# EAGLE design PWM Shield SMD (EAGLE 6.3)
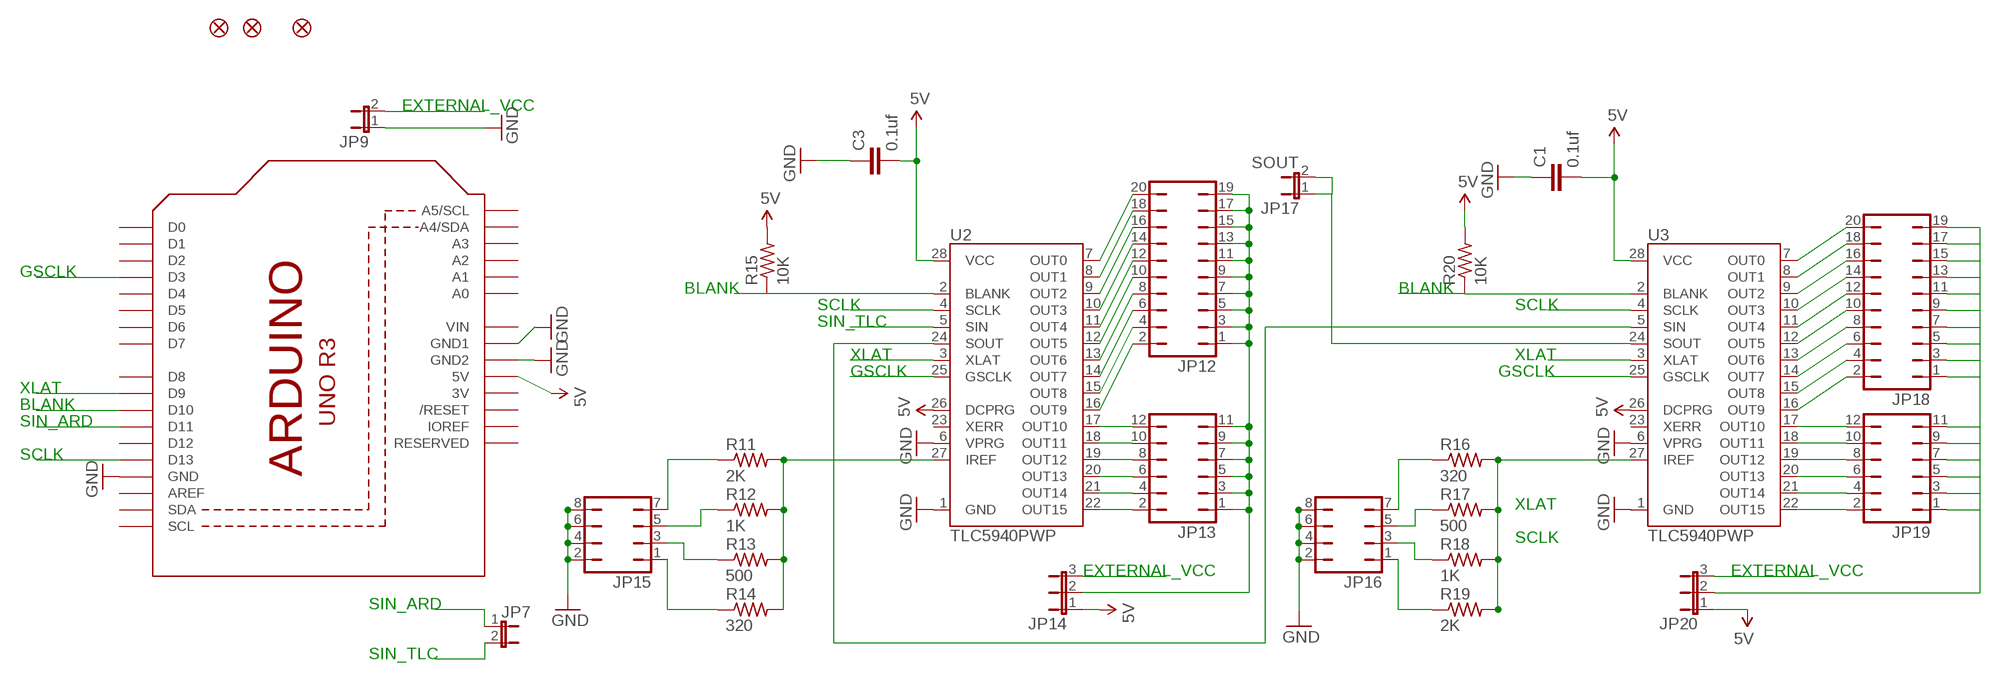
[diagram p0: schematic, sheet 1]

## Parts
C1  0.1uf  C-EUC0603  [C0603]
C3  0.1uf  C-EUC0603  [C0603]
JP1  FIDUCIAL1.5X3  [FIDUCIAL-1.5X3]
JP2  FIDUCIAL1.5X3  [FIDUCIAL-1.5X3]
JP3  FIDUCIAL1.5X3  [FIDUCIAL-1.5X3]
JP7  JP1E  [JP1]
JP9  JP1E  [JP1]
JP12  JP10Q  [JP10Q]
JP13  JP6Q  [JP6Q]
JP14  JP2E  [JP2]
JP15  JP4Q  [JP4Q]
JP16  JP4Q  [JP4Q]
JP17  SOUT  JP1E  [JP1]
JP18  JP10Q  [JP10Q]
JP19  JP6Q  [JP6Q]
JP20  JP2E  [JP2]
R11  2K  R-US_R0603  [R0603]
R12  1K  R-US_0204/7  [0204/7]
R13  500  R-US_0204/7  [0204/7]
R14  320  R-US_0204/7  [0204/7]
R15  10K  R-US_R0603  [R0603]
R16  320  R-US_0204/7  [0204/7]
R17  500  R-US_0204/7  [0204/7]
R18  1K  R-US_0204/7  [0204/7]
R19  2K  R-US_R0603  [R0603]
R20  10K  R-US_R0603  [R0603]
U1  ARDUINOR3-DIMENSION  [ARDUINOR3]
U2  TLC5940PWP  [TSSOP28-GROUNDPAD]
U3  TLC5940PWP  [TSSOP28-GROUNDPAD]

## Nets
5V [VCCPower]: C1.2 C3.2 JP14.1 JP20.1 R15.2 R20.2 U1.5V U2.26(DCPRG) U2.28(VCC) U3.26(DCPRG) U3.28(VCC)
BLANK: R15.1 R20.1 U1.D10 U2.2(BLANK) U3.2(BLANK)
EXTERNAL_VCC [VCCPower]: JP9.2 JP14.3 JP20.3
GND [GND]: C1.1 C3.1 JP9.1 JP15.2 JP15.4 JP15.6 JP15.8 JP16.2 JP16.4 JP16.6 JP16.8 U1.GND U1.GND1 U1.GND2 U2.1(GND) U2.6(VPRG) U3.1(GND) U3.6(VPRG)
GSCLK: U1.D3 U2.25(GSCLK) U3.25(GSCLK)
N$1: JP17.1 JP17.2 U3.24(SOUT)
N$47: JP12.2 U2.16(OUT9)
N$48: JP12.4 U2.15(OUT8)
N$49: JP12.6 U2.14(OUT7)
N$50: JP12.8 U2.13(OUT6)
N$51: JP12.10 U2.12(OUT5)
N$52: JP12.12 U2.11(OUT4)
N$53: JP12.14 U2.10(OUT3)
N$54: JP12.16 U2.9(OUT2)
N$55: JP12.18 U2.8(OUT1)
N$56: JP12.20 U2.7(OUT0)
N$57: JP13.2 U2.22(OUT15)
N$58: JP13.4 U2.21(OUT14)
N$59: JP13.6 U2.20(OUT13)
N$60: JP13.8 U2.19(OUT12)
N$61: JP13.10 U2.18(OUT11)
N$62: JP13.12 U2.17(OUT10)
N$63 [VCCPower]: JP12.1 JP12.3 JP12.5 JP12.7 JP12.9 JP12.11 JP12.13 JP12.15 JP12.17 JP12.19 JP13.1 JP13.3 JP13.5 JP13.7 JP13.9 JP13.11 JP14.2
N$65: R11.2 R12.2 R13.2 R14.2 U2.27(IREF)
N$66: JP15.1 R14.1
N$67: JP15.3 R13.1
N$68: JP15.5 R12.1
N$69: JP15.7 R11.1
N$71: R16.2 R17.2 R18.2 R19.2 U3.27(IREF)
N$72: JP16.1 R19.1
N$73: JP16.3 R18.1
N$74: JP16.5 R17.1
N$75: JP16.7 R16.1
N$77: JP18.2 U3.16(OUT9)
N$78: JP18.4 U3.15(OUT8)
N$79: JP18.6 U3.14(OUT7)
N$80: JP18.8 U3.13(OUT6)
N$81: JP18.10 U3.12(OUT5)
N$82: JP18.12 U3.11(OUT4)
N$83: JP18.14 U3.10(OUT3)
N$84: JP18.16 U3.9(OUT2)
N$85: JP18.18 U3.8(OUT1)
N$86: JP18.20 U3.7(OUT0)
N$87: JP19.2 U3.22(OUT15)
N$88: JP19.4 U3.21(OUT14)
N$89: JP19.6 U3.20(OUT13)
N$90: JP19.8 U3.19(OUT12)
N$91: JP19.10 U3.18(OUT11)
N$92: JP19.12 U3.17(OUT10)
N$93 [VCCPower]: JP18.1 JP18.3 JP18.5 JP18.7 JP18.9 JP18.11 JP18.13 JP18.15 JP18.17 JP18.19 JP19.1 JP19.3 JP19.5 JP19.7 JP19.9 JP19.11 JP20.2
SCLK: U1.D13 U2.4(SCLK) U3.4(SCLK)
SIN_ARD: JP7.1 U1.D11
SIN_TLC: JP7.2 U2.5(SIN)
SOUT_1: U2.24(SOUT) U3.5(SIN)
XLAT: U1.D9 U2.3(XLAT) U3.3(XLAT)
Unconnected: U1.A0 U1.A1 U1.A2 U1.A3 U1.A4(A4/SDA) U1.A5(A5/SCL) U1.AREF U1.D0 U1.D1 U1.D2 U1.D4 U1.D5 U1.D6 U1.D7 U1.D8 U1.D12 U1.IOREF U1.RESERVED U1.RESET(/RESET) U1.SCL U1.SDA U2.23(XERR) U3.23(XERR)

## Notes on the sheet
- EXTERNAL_VCC
- GSCLK
- BLANK | BLANK
- SCLK | SCLK
- SIN_TLC
- XLAT | XLAT
- GSCLK | GSCLK
- XLAT
- BLANK
- SIN_ARD
- SCLK
- XLAT
- SCLK
- EXTERNAL_VCC | EXTERNAL_VCC
- SIN_ARD
- SIN_TLC

## Power pins joined to a net without a drawn wire
3V: U1.3V
VIN: U1.VIN

## Library data of the parts
C1 C3 = rcl:C-EU: CAPACITOR, European symbol
JP1-JP3 = SparkFun:FIDUCIAL: Fiducial Alignment Points Various fiducial points for machine vision alignment.
JP7 JP9 JP17 = jumper:JP1E: JUMPER
JP12 JP18 = jumper:JP10Q: JUMPER
JP13 JP19 = jumper:JP6Q: JUMPER
JP14 JP20 = jumper:JP2E: JUMPER
JP15 JP16 = jumper:JP4Q: JUMPER
R11-R20 = resistor:R-US_: RESISTOR, American symbol
U1 = adafruit:ARDUINOR3: This is a new object for the new Arduino R3 - with extra pins that you may want to use (such as IOref, and duplicated A4/A5
U2 U3 = SparkFun:TLC5940: TI TLC5940 16-channel LED Driver with Dot Correction and Grayscale PWM Control The TLC5940 is a 16-channel, constant-current sink LED driver. Each channel has an individually adjustable 4096-step grayscale PWM brightness control and a 64-step, constant-current sink (dot correction). The dot correction adjusts the brightness variations between LED channels and other LED drivers. The dot correction data is stored in an integrated EEPROM. Both grayscale control and dot correction are accessible via a serial interface. A single external resistor sets the maximum current value of all 16 channels. Packages: 28-pin HTSSOP 32-pin 5x5mm QFN 28-pin DIP

## Net classes
0 default: width 0.203 mm
1 VCCPower: width 0.356 mm
2 GND: width 0.356 mm

## Board
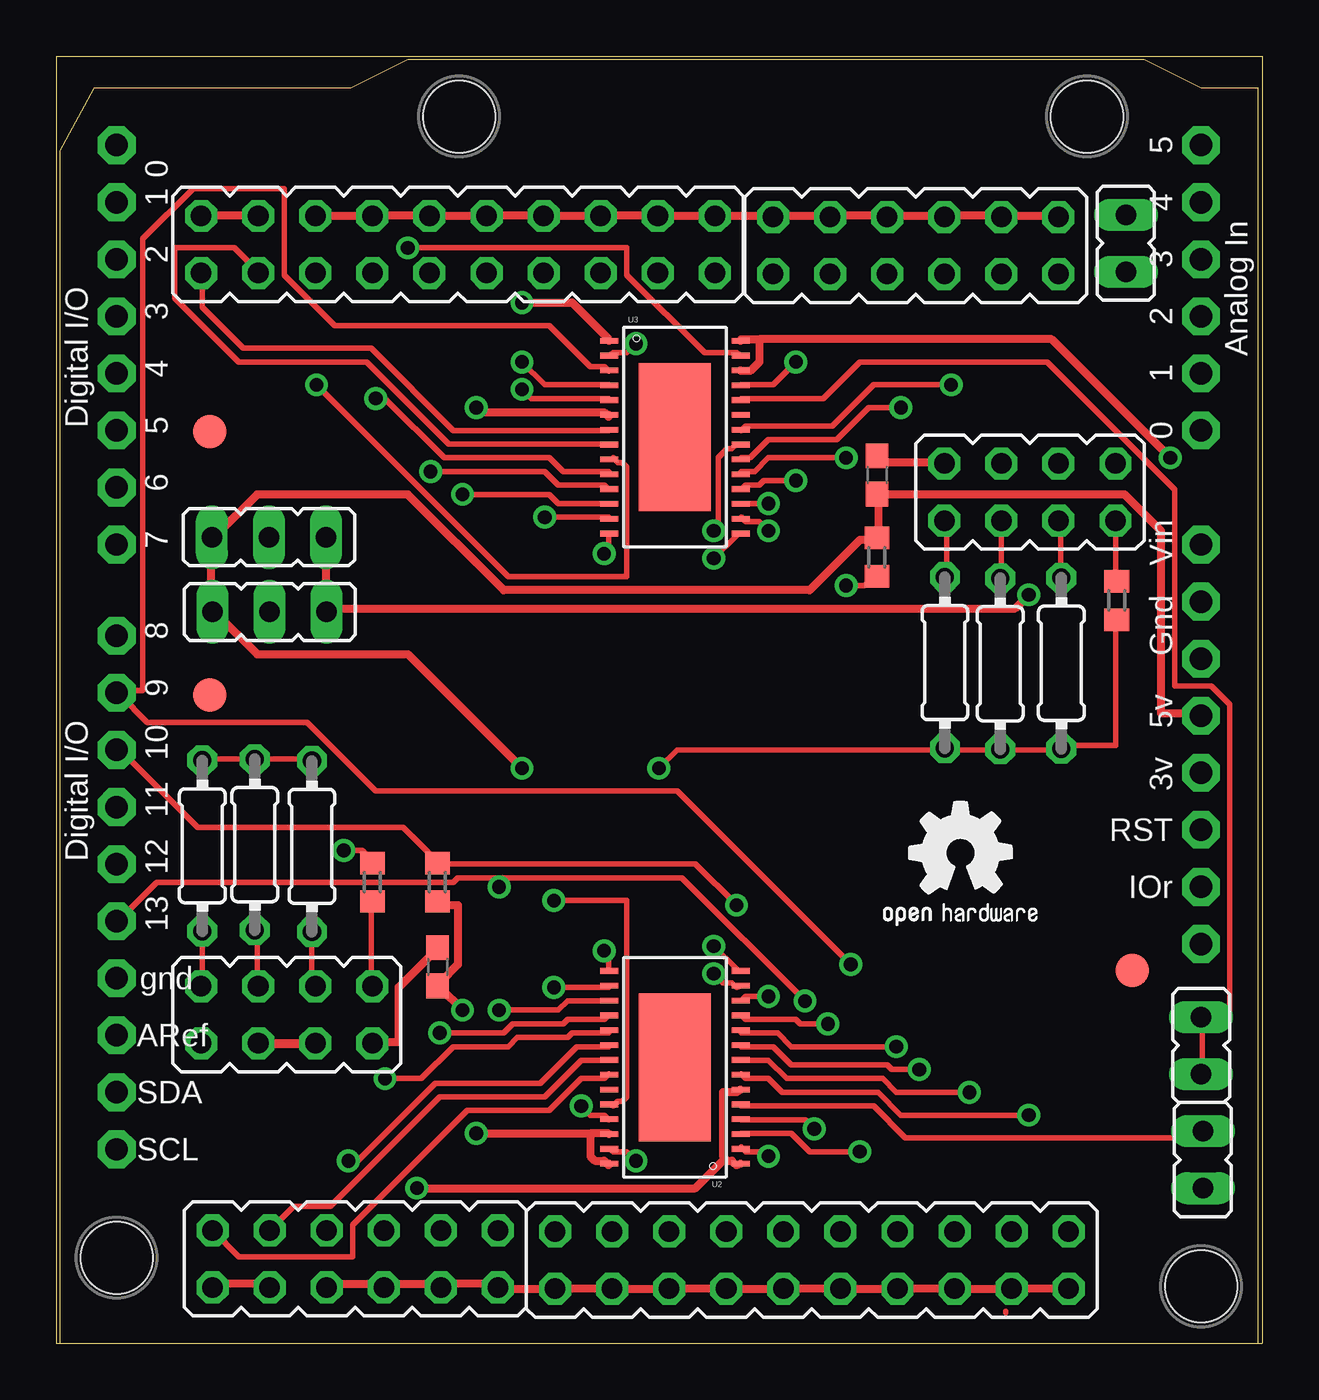
[diagram p1: board, top side]
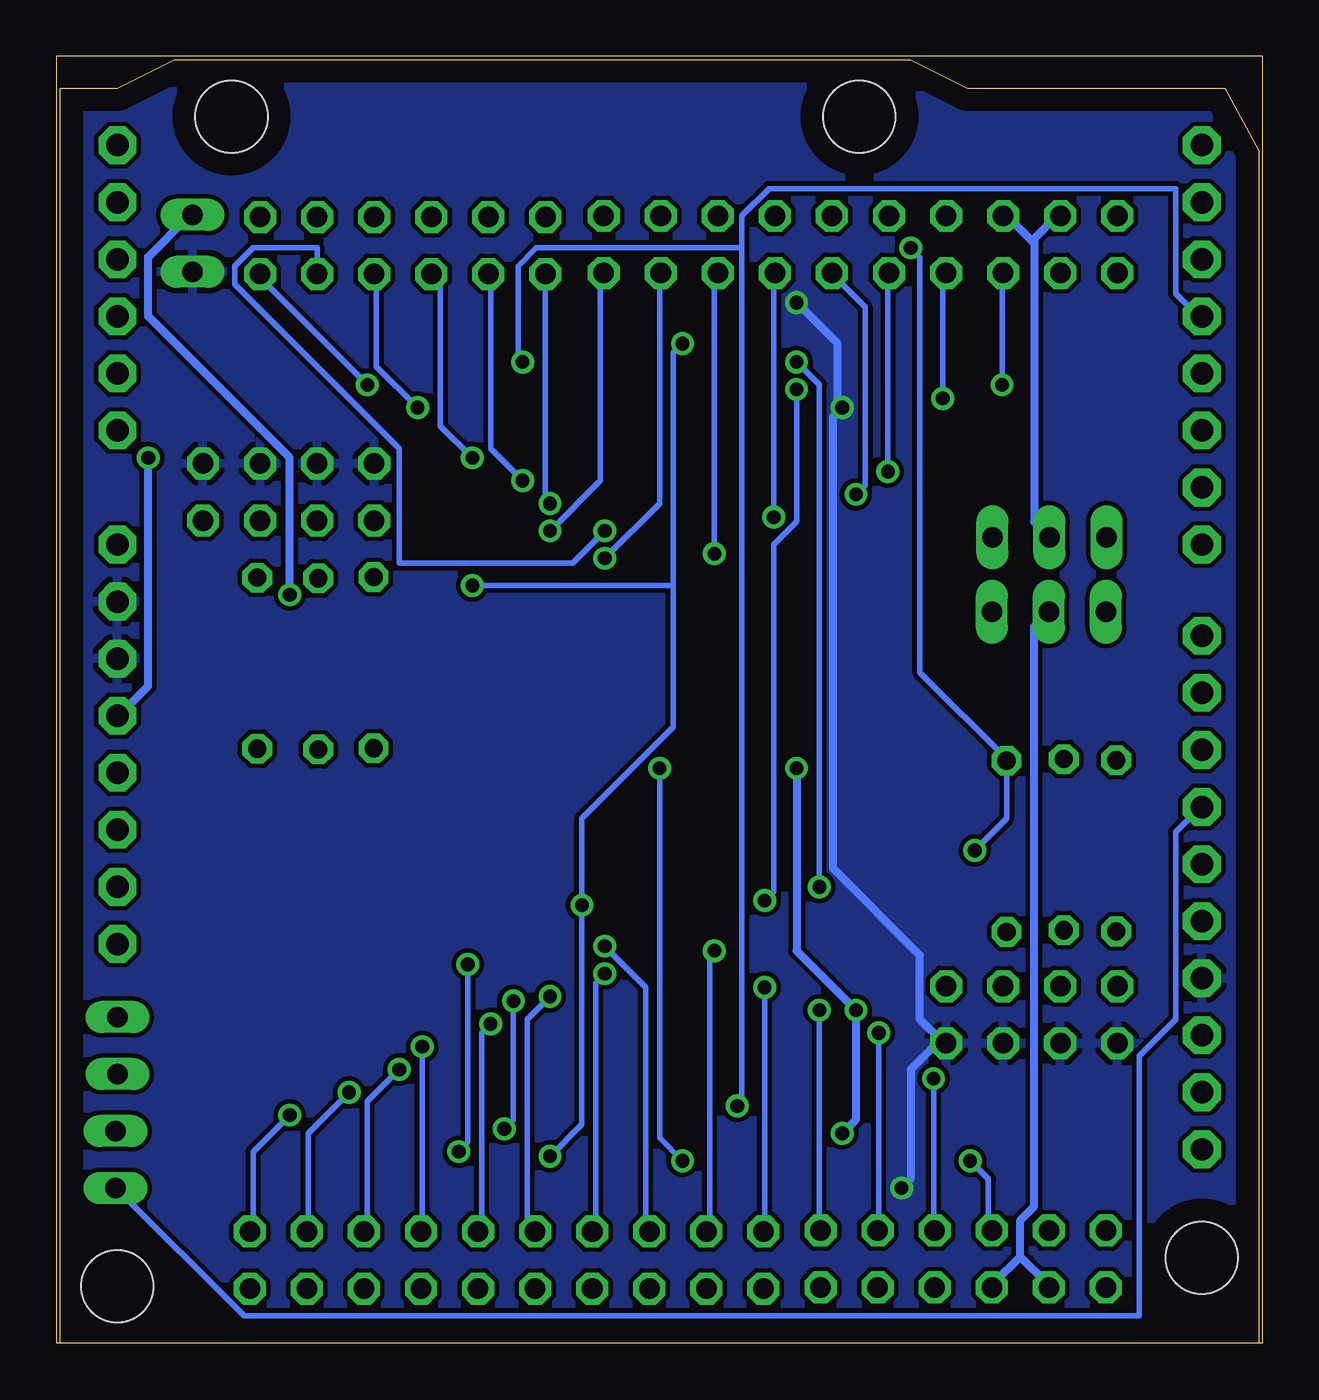
[diagram p2: board, bottom side, seen from below]

Size 53.68 x 57.3 mm. Coordinates in mm from the lower left corner, seen from the top.
Outline: 53.67,0 0,0 0,57.3 53.67,57.3 53.67,0
Outline: 53.67,0 53.68,0
Copper layers (1*16): Top 0.035mm / dielectric 1.5mm / Bottom 0.035mm
Design rules "default": minimum track width 10mil, minimum drill 24mil, track to track 8mil, track to pad 8mil, pad to pad 8mil, via to via 8mil, smd to smd 8mil, copper to edge 40mil, drill to drill 8mil, minimum pad ring 10mil, minimum via ring 8mil, stop-mask expansion 4mil, vias tented up to drill 0mil, thermal gap 10mil
Holes 3.2 mm at 17.93,54.61 45.87,54.61 2.69,3.81 50.95,2.54
tRestrict: area 0.8,2 to 4.5,5.7; area 49.2,0.8 to 52.8,4.5; area 44.1,52.8 to 47.7,56.5; area 16.1,52.8 to 19.7,56.5
bRestrict: area 0.8,2 to 4.5,5.7; area 49.2,0.8 to 52.8,4.5; area 16.1,52.8 to 19.7,56.5; area 44.1,52.8 to 47.7,56.5

### Footprints (pad centres in the part's own frame; a part is rotated, then mirrored left to right if it is on the bottom)
C0603 = smd 1.1 x 1: 1 -0.85,0; 2 0.85,0
FIDUCIAL-1.5X3 = smd 1.5 x 1.5: 1 0,0
JP1 = drill 0.914 long: 1 0,-1.27; 2 0,1.27
JP10Q = drill 0.914 octagon: 1 -11.43,-1.27; 2 -11.43,1.27; 3 -8.89,-1.27; 4 -8.89,1.27; 5 -6.35,-1.27; 6 -6.35,1.27; 7 -3.81,-1.27; 8 -3.81,1.27; 9 -1.27,-1.27; 10 -1.27,1.27; 11 1.27,-1.27; 12 1.27,1.27; 13 3.81,-1.27; 14 3.81,1.27; 15 6.35,-1.27; 16 6.35,1.27; 17 8.89,-1.27; 18 8.89,1.27; 19 11.43,-1.27; 20 11.43,1.27
JP6Q = drill 0.914 octagon: 1 -6.35,-1.27; 2 -6.35,1.27; 3 -3.81,-1.27; 4 -3.81,1.27; 5 -1.27,-1.27; 6 -1.27,1.27; 7 1.27,-1.27; 8 1.27,1.27; 9 3.81,-1.27; 10 3.81,1.27; 11 6.35,-1.27; 12 6.35,1.27
JP2 = drill 0.914 long: 1 -2.54,0; 2 0,0; 3 2.54,0
JP4Q = drill 0.914 octagon: 1 -3.81,-1.27; 2 -3.81,1.27; 3 -1.27,-1.27; 4 -1.27,1.27; 5 1.27,-1.27; 6 1.27,1.27; 7 3.81,-1.27; 8 3.81,1.27
R0603 = smd 1 x 1.1: 1 -0.85,0; 2 0.85,0
0204/7 = drill 0.813 octagon: 1 -3.81,0; 2 3.81,0
ARDUINOR3 = drill 1 pad 1.676 octagon: 3V 25.4,2.54; 5V 27.94,2.54; A0 40.64,2.54; A1 43.18,2.54; A2 45.72,2.54; A3 48.26,2.54; A4 50.8,2.54; A5 53.34,2.54; AREF 13.716,50.8; D0 53.34,50.8; D1 50.8,50.8; D2 48.26,50.8; D3 45.72,50.8; D4 43.18,50.8; D5 40.64,50.8; D6 38.1,50.8; D7 35.56,50.8; D8 31.496,50.8; D9 28.956,50.8; D10 26.416,50.8; D11 23.876,50.8; D12 21.336,50.8; D13 18.796,50.8; GND 16.256,50.8; GND1 33.02,2.54; GND2 30.48,2.54; IOREF 20.32,2.54; RESERVED 17.78,2.54; RESET 22.86,2.54; SCL 8.636,50.8; SDA 11.176,50.8; VIN 35.56,2.54
TSSOP28-GROUNDPAD = smd 0.8 x 0.25: 1 -2.921,4.298; 2 -2.921,3.637; 3 -2.921,2.977; 4 -2.921,2.317; 5 -2.921,1.656; 6 -2.921,0.996; 7 -2.921,0.335; 8 -2.927,-0.325; 9 -2.921,-0.985; 10 -2.921,-1.646; 11 -2.921,-2.306; 12 -2.921,-2.967; 13 -2.921,-3.627; 14 -2.921,-4.287; 15 2.921,-4.287; 16 2.921,-3.627; 17 2.921,-2.967; 18 2.921,-2.306; 19 2.921,-1.646; 20 2.921,-0.985; 21 2.927,-0.325; 22 2.921,0.335; 23 2.921,0.996; 24 2.921,1.656; 25 2.921,2.317; 26 2.921,2.977; 27 2.921,3.637; 28 2.921,4.298 | smd 3.2 x 6.6: 29 0,0.005

### Placement (x,y rotation side)
C1  16.97,16.76 270 top
C3  36.53,38.66 270 top
JP1  6.83,40.59 0 top
JP2  6.83,28.85 0 top
JP3  47.88,16.61 0 top
JP7  51.03,8.18 0 top
JP9  47.6,48.97 0 top
JP12  33.63,3.71 0 top
JP13  13.31,3.76 0 top
JP14  9.5,32.56 0 top
JP15  43.33,37.9 0 top
JP16  10.26,14.63 180 top
JP17  50.95,13.26 0 top
JP18  17.88,48.92 180 top
JP19  38.25,48.87 180 top
JP20  9.47,35.89 0 top
R11  47.19,33.07 270 top
R12  44.73,30.28 270 top
R13  42.01,30.25 270 top
R14  39.55,30.3 270 top
R15  36.53,35 90 top
R16  6.5,22.15 90 top
R17  8.84,22.2 90 top
R18  11.38,22.12 90 top
R19  14.07,20.52 90 top
R20  16.97,20.52 270 top
U1  53.49,0 90 top
U2  27.53,12.29 180 top
U3  27.53,40.34 0 top
U$2  [OSHW2]  36.42,17.55 0 top

### Tracks (layer width: path | path; a pad name or v marks a point on that pad's centre or on a via)
5V  (via drill 0.61)
  Top 0.356: 23.77,9.35 23.77,8.33 23.98,8.13 24.38,8.13 24.59,7.92 U2.28 | 23.77,9.35 24.59,9.35 U2.26 | R20.2 17.07,19.51 17.88,19.51 17.88,16.87 17.07,16.05 C1.2 17.07,15.85 v18.08,14.83 | v18.69,9.35 23.77,9.35 | 36.58,37.8 36.58,35.97 R15.2 36.37,35.76 35.76,35.76 33.53,33.53 19.91,33.53 15.65,37.8 8.94,37.8 7.11,35.97 JP20.1 6.91,35.76 6.91,32.72 JP14.1 7.11,32.51 8.94,30.68 15.65,30.68 v20.73,25.6 | 31.29,44.7 31.29,43.69 30.89,43.28 30.48,43.28 U3.26 | 31.29,44.7 30.48,44.7 U3.28 | 31.29,44.7 44.3,44.7 v49.58,39.42 | 36.58,37.8 47.55,37.8 49.17,36.17 49.17,28.04 50.8,28.04 U1.5V 51,28.04 | 36.58,37.8 C3.2
  Bottom 0.356: v18.69,9.35 18.08,9.96 v18.08,14.83 20.73,17.48 v20.73,25.6 | v49.58,39.42 49.58,29.26 50.8,28.04 U1.5V
BLANK  (via drill 0.61)
  Top 0.254: v31.7,8.33 31.5,8.53 30.68,8.53 30.48,8.74 U2.2 | v30.28,19.51 28.45,21.34 17.07,21.34 R20.1 16.87,21.54 15.44,22.96 6.3,22.96 2.84,26.42 U1.D10 | v25.81,44.5 25.4,44.09 24.79,44.09 U3.2 | v35.15,33.73 35.97,33.73 36.37,34.14 R15.1
  Bottom 0.254: v31.7,8.33 30.28,9.75 v30.28,19.51 30.28,23.37 26.21,27.43 26.21,33.73 | v25.81,44.5 26.21,44.09 26.21,33.73 | 26.21,33.73 v35.15,33.73
EXTERNAL_VCC  (via drill 0.61)
  Top 0.356: JP20.3 11.99,35.76 11.99,32.72 JP14.3 12.19,32.72 42.67,32.72 v43.28,33.33
  Bottom 0.356: v43.28,33.33 43.28,39.42 49.58,45.72 49.58,48.36 47.75,50.19 JP9.2
GND  (via drill 0.61)
  Top 0.356: 29.77,8.23 29.67,8.33 29.67,11.18 30.28,11.18 U2.6 | 29.77,8.23 29.87,8.13 30.07,8.13 30.28,7.92 U2.1 | v18.69,41.66 18.9,41.45 24.38,41.45 24.59,41.25 U3.6 | v20.73,46.33 22.96,46.33 24.59,44.7 U3.1 | C1.1 16.87,17.48 15.24,15.85 15.24,13.41 14.22,13.41 JP16.2 | C3.1 36.58,39.42 36.78,39.22 39.42,39.22 JP15.2 | 29.77,8.23 28.45,6.91 v16.05,6.91
  Top 0.406: JP16.6 JP16.4
  Bottom 0.356: v20.73,46.33 18.9,44.5 18.9,41.66 v18.69,41.66 19.1,41.25 19.1,21.13 15.24,17.27 15.24,14.43 14.22,13.41 JP16.2 14.43,13.41 15.65,12.19 15.65,7.32 v16.05,6.91
  pour Bottom: 55.88,59.13 56.08,5.28 56.49,-2.24 48.36,-2.44 -2.64,-2.44 -2.84,6.91 -2.03,58.93 -1.63,59.13
GSCLK  (via drill 0.61)
  Top 0.254: v23.37,10.57 23.77,10.16 24.38,10.16 24.59,9.96 U2.25 | v32.92,43.69 31.9,42.67 30.48,42.67 U3.25
  Bottom 0.254: v23.37,10.57 23.16,10.77 23.16,48.77 | 23.16,48.77 23.16,50.19 21.95,51.41 3.86,51.41 3.86,46.74 2.84,45.72 U1.D3 | v32.92,43.69 33.12,43.89 33.12,47.95 32.31,48.77 23.16,48.77
N$1
  Top 0.254: U3.24 30.48,42.06 34.14,42.06 35.76,43.69 44.09,43.69 49.78,38 49.78,29.26 51.41,29.26 52.22,28.45 52.22,14.63 51,14.63 JP17.2 51,14.43 51,11.99 JP17.1
N$2
  Top 0.254: 42.27,1.42 42.27,1.37
N$47  (via drill 0.61)
  Top 0.254: v22.15,15.85 24.59,15.85 U2.16
  Bottom 0.254: v22.15,15.85 22.15,5.08 JP12.2
N$48  (via drill 0.61)
  Top 0.254: v24.38,17.48 24.59,17.48 24.59,16.66 U2.15
  Bottom 0.254: v24.38,17.48 24.59,17.27 24.59,5.08 JP12.4
N$49  (via drill 0.61)
  Top 0.254: v29.26,17.68 30.28,16.66 U2.14
  Bottom 0.254: v29.26,17.68 27.43,15.85 27.43,5.08 JP12.6
N$50  (via drill 0.61)
  Top 0.254: v29.26,16.46 29.67,16.05 30.07,16.05 30.28,15.85 U2.13
  Bottom 0.254: v29.26,16.46 29.67,16.05 29.67,5.08 JP12.8
N$51  (via drill 0.61)
  Top 0.254: v31.7,15.44 30.68,15.44 30.48,15.24 U2.12
  Bottom 0.254: v31.7,15.44 32.72,14.43 32.72,5.28 32.51,5.08 JP12.10
N$52  (via drill 0.61)
  Top 0.254: v34.34,14.22 33.12,14.22 32.92,14.43 30.68,14.43 30.48,14.63 U2.11
  Bottom 0.254: v34.34,14.22 34.75,13.82 34.75,5.08 JP12.12
N$53  (via drill 0.61)
  Top 0.254: v37.39,13.21 32.72,13.21 32.11,13.82 30.48,13.82 U2.10
  Bottom 0.254: v37.39,13.21 37.39,5.08 JP12.14
N$54  (via drill 0.61)
  Top 0.254: v38.4,12.19 37.19,12.19 36.98,12.39 32.72,12.39 31.9,13.21 30.48,13.21 U2.9
  Bottom 0.254: v38.4,12.19 39.83,10.77 39.83,5.08 JP12.16
N$55  (via drill 0.61)
  Top 0.254: v40.64,11.18 37.39,11.18 36.78,11.79 32.51,11.79 31.7,12.6 30.48,12.6 U2.8
  Bottom 0.254: v40.64,11.18 42.47,9.35 42.47,5.08 JP12.18
N$56  (via drill 0.61)
  Top 0.254: v43.28,10.16 37.59,10.16 36.58,11.18 32.31,11.18 31.7,11.79 30.68,11.79 30.48,11.99 U2.7
  Bottom 0.254: v43.28,10.16 44.91,8.53 44.91,5.08 JP12.20
N$57
  Top 0.254: JP13.2 8.13,3.86 13.21,3.86 13.21,5.28 18.29,10.36 21.95,10.36 23.37,11.79 24.38,11.79 24.59,11.99 U2.22
N$58
  Top 0.254: JP13.4 10.57,6.1 12.19,6.1 17.07,10.97 21.74,10.97 23.37,12.6 24.59,12.6 U2.21
N$59  (via drill 0.61)
  Top 0.254: v13,8.13 13.41,8.13 16.87,11.58 21.54,11.58 23.16,13.21 24.59,13.21 U2.20
  Bottom 0.254: v13,8.13 12.19,7.32 12.19,5.08 JP13.6
N$60  (via drill 0.61)
  Top 0.254: v14.63,11.79 16.26,11.79 17.68,13.21 20.12,13.21 20.52,13.61 22.76,13.61 22.96,13.82 24.59,13.82 U2.19
  Bottom 0.254: v14.63,11.79 14.63,5.08 JP13.8
N$61  (via drill 0.61)
  Top 0.254: v17.07,13.82 19.91,13.82 20.32,14.22 22.56,14.22 22.76,14.43 24.38,14.43 24.59,14.63 U2.18
  Bottom 0.254: v17.07,13.82 17.07,5.08 JP13.10
N$62  (via drill 0.61)
  Top 0.254: v19.71,14.83 22.35,14.83 22.76,15.24 24.59,15.24 U2.17
  Bottom 0.254: v19.71,14.83 19.71,5.08 JP13.12
N$63
  Top 0.356: JP12.19 JP12.17 JP12.15 JP12.13 JP12.11 JP12.9 JP12.7 JP12.5 JP12.3 JP12.1 19.71,2.44 JP13.11 19.51,2.64 17.27,2.64 JP13.9 17.07,2.64 14.63,2.64 JP13.7 14.43,2.64 12.19,2.64 JP13.5 | JP13.1 7.11,2.64 9.35,2.64 JP13.3
  Bottom 0.356: JP14.2 10.16,31.9 10.16,6.1 10.77,5.49 10.77,3.86 | 10.77,3.86 9.55,2.64 JP13.3 | 10.77,3.86 11.99,2.64 JP13.5
N$65  (via drill 0.61)
  Top 0.254: R11.2 47.14,32.11 47.14,26.62 44.91,26.62 R12.2 44.7,26.42 42.06,26.42 R13.2 41.86,26.42 39.62,26.42 R14.2 39.42,26.42 27.64,26.42 v26.82,25.6 | v25.81,8.13 25.4,8.53 24.79,8.53 U2.27
  Bottom 0.254: v25.81,8.13 26.82,9.14 v26.82,25.6
N$66
  Top 0.254: R14.1 39.62,34.14 39.62,36.58 JP15.1
N$67
  Top 0.254: JP15.3 42.06,34.14 R13.1
N$68
  Top 0.254: R12.1 44.7,34.14 44.7,36.58 JP15.5
N$69
  Top 0.254: JP15.7 47.14,33.93 R11.1
N$71  (via drill 0.61)
  Top 0.254: R16.2 6.5,26.01 R17.2 11.38,26.01 R18.2 | v15.65,48.77 25.4,48.77 25.4,47.55 28.85,44.09 30.28,44.09 U3.27 | v12.8,21.95 13.61,21.95 14.02,21.54 R19.2
  Bottom 0.254: v15.65,48.77 15.24,48.36 15.24,29.87 11.38,26.01 R18.2 11.38,23.37 v12.8,21.95
N$72
  Top 0.254: R19.1 14.02,19.51 14.02,16.05 JP16.1
N$73
  Top 0.254: R18.1 11.38,16.05 JP16.3
N$74
  Top 0.254: R17.1 8.94,18.29 8.94,16.05 JP16.5
N$75
  Top 0.254: R16.1 6.5,16.05 JP16.7
N$77  (via drill 0.61)
  Top 0.254: v31.7,36.17 31.29,36.58 30.68,36.58 30.48,36.78 U3.16
  Bottom 0.254: v31.7,36.17 29.46,38.41 29.46,47.55 JP18.2
N$78  (via drill 0.61)
  Top 0.254: v29.26,34.95 30.28,35.97 U3.15
  Bottom 0.254: v29.26,34.95 26.82,37.39 26.82,47.55 JP18.4
N$79  (via drill 0.61)
  Top 0.254: v24.38,35.15 24.59,35.15 24.59,35.97 U3.14
  Bottom 0.254: v24.38,35.15 24.38,47.55 JP18.6
N$80  (via drill 0.61)
  Top 0.254: v21.74,36.78 24.59,36.78 U3.13
  Bottom 0.254: v21.74,36.78 21.74,47.55 JP18.8
N$81  (via drill 0.61)
  Top 0.254: v18.08,37.8 21.95,37.8 22.35,37.39 24.59,37.39 U3.12
  Bottom 0.254: v18.08,37.8 17.68,38.2 17.68,46.13 19.1,47.55 JP18.10
N$82  (via drill 0.61)
  Top 0.254: v16.66,38.81 21.74,38.81 22.35,38.2 24.38,38.2 24.59,38 U3.11
  Bottom 0.254: v16.66,38.81 16.66,47.55 JP18.12
N$83  (via drill 0.61)
  Top 0.254: v14.22,42.06 14.63,42.06 17.27,39.42 21.95,39.42 22.56,38.81 24.59,38.81 U3.10
  Bottom 0.254: v14.22,42.06 14.22,47.55 JP18.14
N$84  (via drill 0.61)
  Top 0.254: v11.58,42.67 20.12,34.14 25.4,34.14 25.4,39.01 25.2,39.22 24.99,39.22 24.79,39.42 U3.9
  Bottom 0.254: v11.58,42.67 11.58,47.55 JP18.16
N$85
  Top 0.254: U3.8 24.59,40.03 17.48,40.03 13.82,43.69 8.13,43.69 5.28,46.53 5.28,48.77 7.92,48.77 8.94,47.75 JP18.18
N$86
  Top 0.254: U3.7 24.59,40.64 17.68,40.64 14.02,44.3 8.33,44.3 6.5,46.13 6.5,47.55 JP18.20
N$87  (via drill 0.61)
  Top 0.254: v39.83,42.67 36.37,42.67 34.54,40.84 30.68,40.84 30.48,40.64 U3.22
  Bottom 0.254: v39.83,42.67 44.5,47.35 44.5,47.55 JP19.2
N$88  (via drill 0.61)
  Top 0.254: v29.26,36.17 29.46,36.17 29.46,39.42 29.87,39.83 30.07,39.83 30.28,40.03 U3.21
  Bottom 0.254: v29.26,36.17 30.68,34.75 38.4,34.75 38.4,39.83 45.72,47.14 45.72,47.95 44.91,48.77 42.06,48.77 JP19.4
N$89  (via drill 0.61)
  Top 0.254: v37.59,41.66 36.17,41.66 34.75,40.23 31.7,40.23 30.89,39.42 30.48,39.42 U3.20
  Bottom 0.254: v37.59,41.66 39.42,43.48 39.42,47.55 JP19.6
N$90  (via drill 0.61)
  Top 0.254: v35.15,39.42 31.7,39.42 31.09,38.81 30.48,38.81 U3.19
  Bottom 0.254: v35.15,39.42 36.58,40.84 36.58,47.14 36.98,47.55 JP19.8
N$91  (via drill 0.61)
  Top 0.254: v32.92,38.41 31.5,38.41 31.29,38.2 30.68,38.2 30.48,38 U3.18
  Bottom 0.254: v32.92,38.41 34.34,39.83 34.34,47.55 JP19.10
N$92  (via drill 0.61)
  Top 0.254: v31.7,37.39 30.48,37.39 U3.17
  Bottom 0.254: v31.7,37.39 31.9,37.59 JP19.12
N$93
  Top 0.356: 42.06,50.19 39.62,50.19 JP19.5 39.42,50.19 36.98,50.19 | 42.06,50.19 44.5,50.19 JP19.1 | 42.06,50.19 JP19.3 | 36.98,50.19 34.54,50.19 JP19.9 34.34,50.19 31.9,50.19 | 31.9,50.19 JP18.1 JP18.3 JP18.5 JP18.7 JP18.9 JP18.11 JP18.13 JP18.15 | 31.9,50.19 JP19.11 | 36.98,50.19 JP19.7 | JP18.17 JP18.19
  Bottom 0.356: JP20.2 10.16,36.58 10.16,48.97 | 10.16,48.97 10.16,49.17 9.14,50.19 JP18.17 | 10.16,48.97 11.38,50.19 JP18.15
SCLK  (via drill 0.61)
  Top 0.254: v33.73,9.55 33.32,9.96 30.48,9.96 U2.4 | v33.32,15.24 27.84,20.73 19.71,20.73 | 19.71,20.73 17.88,20.73 17.68,20.52 4.47,20.52 2.84,18.9 U1.D13 | v20.73,43.69 21.74,42.67 24.59,42.67 U3.4 | 19.71,20.73 v19.71,20.32
  Bottom 0.254: v33.73,9.55 33.32,9.96 v33.32,15.24 | v20.73,43.69 19.71,42.67 v19.71,20.32
SIN_ARD
  Bottom 0.254: JP7.1 51,6.91 45.31,1.22 5.49,1.22 5.49,12.8 3.86,14.43 3.86,22.76 2.84,23.77 U1.D11
SIN_TLC
  Top 0.254: U2.5 30.48,10.57 36.37,10.57 37.8,9.14 50.8,9.14 51,9.35 JP7.2
SOUT_1  (via drill 0.61)
  Top 0.254: v22.15,19.71 25.4,19.71 25.4,10.97 25.2,10.77 24.99,10.77 24.79,10.57 U2.24 | v20.73,42.47 21.13,42.06 24.59,42.06 U3.5
  Bottom 0.254: v22.15,19.71 21.74,20.12 21.74,35.56 20.73,36.58 v20.73,42.47
XLAT  (via drill 0.61)
  Top 0.254: v35.76,8.53 33.53,8.53 32.72,9.35 30.48,9.35 U2.3 | v35.36,16.87 27.64,24.59 14.22,24.59 11.18,27.64 4.06,27.64 2.84,28.85 U1.D9 2.84,29.06 3.86,29.06 3.86,49.17 6.1,51.41 10.16,51.41 10.16,47.55 12.4,45.31 21.95,45.31 23.77,43.48 24.38,43.48 24.59,43.28 U3.3
  Bottom 0.254: v35.76,8.53 35.36,8.94 v35.36,16.87

### Text on the board
tValues: VCC | EXT_VCC | GND | 5v | EXT_VCC | V1.0 | practicalmaker.com | Jump | SIN for | Master | GND | SIN | VCC